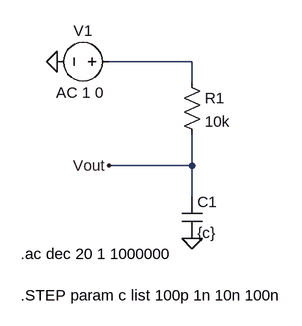
[diagram p0: schematic low_pass_c_sweep.asc]
low_pass_c_sweep.asc, the LTspice schematic file:
Version 4
SHEET 1 880 680
WIRE 208 -16 80 -16
WIRE 208 16 208 -16
WIRE 208 144 208 96
WIRE 208 144 80 144
WIRE 208 192 208 144
FLAG 80 144 Vout
FLAG 208 256 0
FLAG 0 -16 0
SYMBOL cap 192 192 R0
SYMATTR InstName C1
SYMATTR Value {c}
SYMBOL res 192 0 R0
SYMATTR InstName R1
SYMATTR Value 10k
SYMBOL voltage 96 -16 R90
WINDOW 0 -32 56 VBottom 2
WINDOW 3 32 56 VTop 2
WINDOW 123 63 61 VBottom 2
WINDOW 39 0 0 Left 0
SYMATTR InstName V1
SYMATTR Value ""
SYMATTR Value2 AC 1 0
TEXT -56 280 Left 2 !.ac dec 20 1 1000000
TEXT -56 344 Left 2 !.STEP param c list 100p 1n 10n 100n

The netlist it stands for:
* low_pass_c_sweep.asc
C1 Vout 0 {c}
R1 N001 Vout 10k
V1 N001 0 AC 1 0
.ac dec 20 1 1000000
.STEP param c list 100p 1n 10n 100n
.backanno
.end